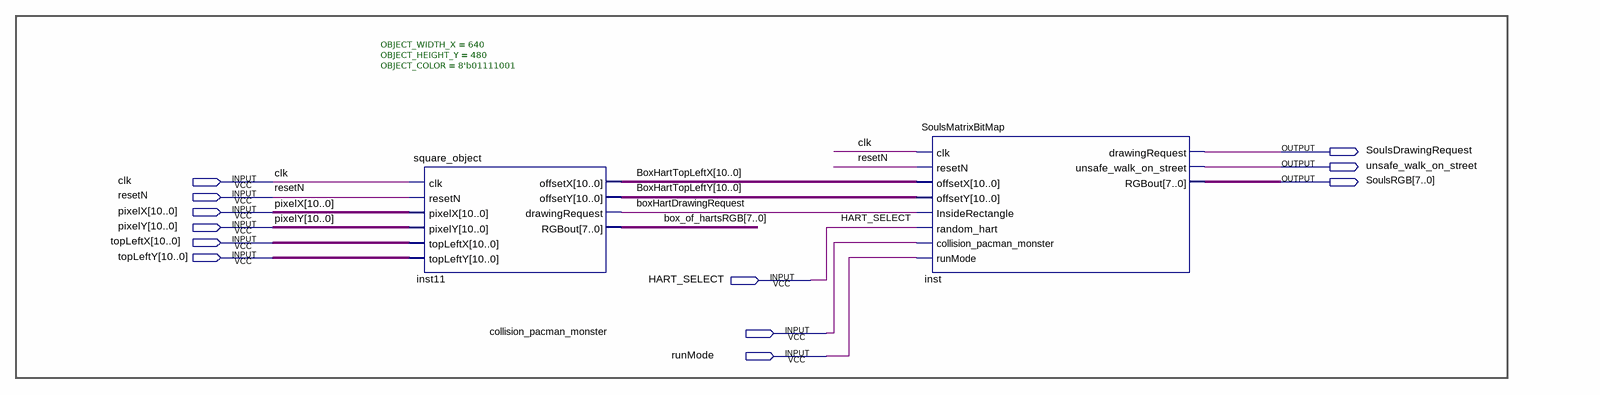
[diagram p0: schematic sheet]
// Quartus schematic SOULS_DISPALY.bdf as structural Verilog: 2 symbols, 12 pins
module SOULS_DISPALY (
  input  clk,
  input  resetN,
  input  [10:0] pixelX,
  input  [10:0] pixelY,
  input  [10:0] topLeftX,
  input  [10:0] topLeftY,
  input  HART_SELECT,
  input  collision_pacman_monster,
  input  runMode,
  output SoulsDrawingRequest,
  output unsafe_walk_on_street,
  output [7:0] SoulsRGB
);

  wire boxHartDrawingRequest;
  wire [7:0] box_of_hartsRGB;
  wire [10:0] BoxHartTopLeftX, BoxHartTopLeftY;

  square_object #(.OBJECT_WIDTH_X(640), .OBJECT_HEIGHT_Y(480), .OBJECT_COLOR(8'b01111001)) inst11 (
    .clk(clk), .resetN(resetN), .pixelX(pixelX), .pixelY(pixelY), .topLeftX(topLeftX), .topLeftY(topLeftY),
    .offsetX(BoxHartTopLeftX), .offsetY(BoxHartTopLeftY), .drawingRequest(boxHartDrawingRequest),
    .RGBout(box_of_hartsRGB));
  SoulsMatrixBitMap inst (
    .clk(clk), .resetN(resetN), .offsetX(BoxHartTopLeftX), .offsetY(BoxHartTopLeftY),
    .InsideRectangle(boxHartDrawingRequest), .random_hart(HART_SELECT),
    .collision_pacman_monster(collision_pacman_monster), .runMode(runMode),
    .drawingRequest(SoulsDrawingRequest), .unsafe_walk_on_street(unsafe_walk_on_street), .RGBout(SoulsRGB));
endmodule
